# Altium schematic sheet DRV8300_VOLTAGE_REG.SchDoc
size B
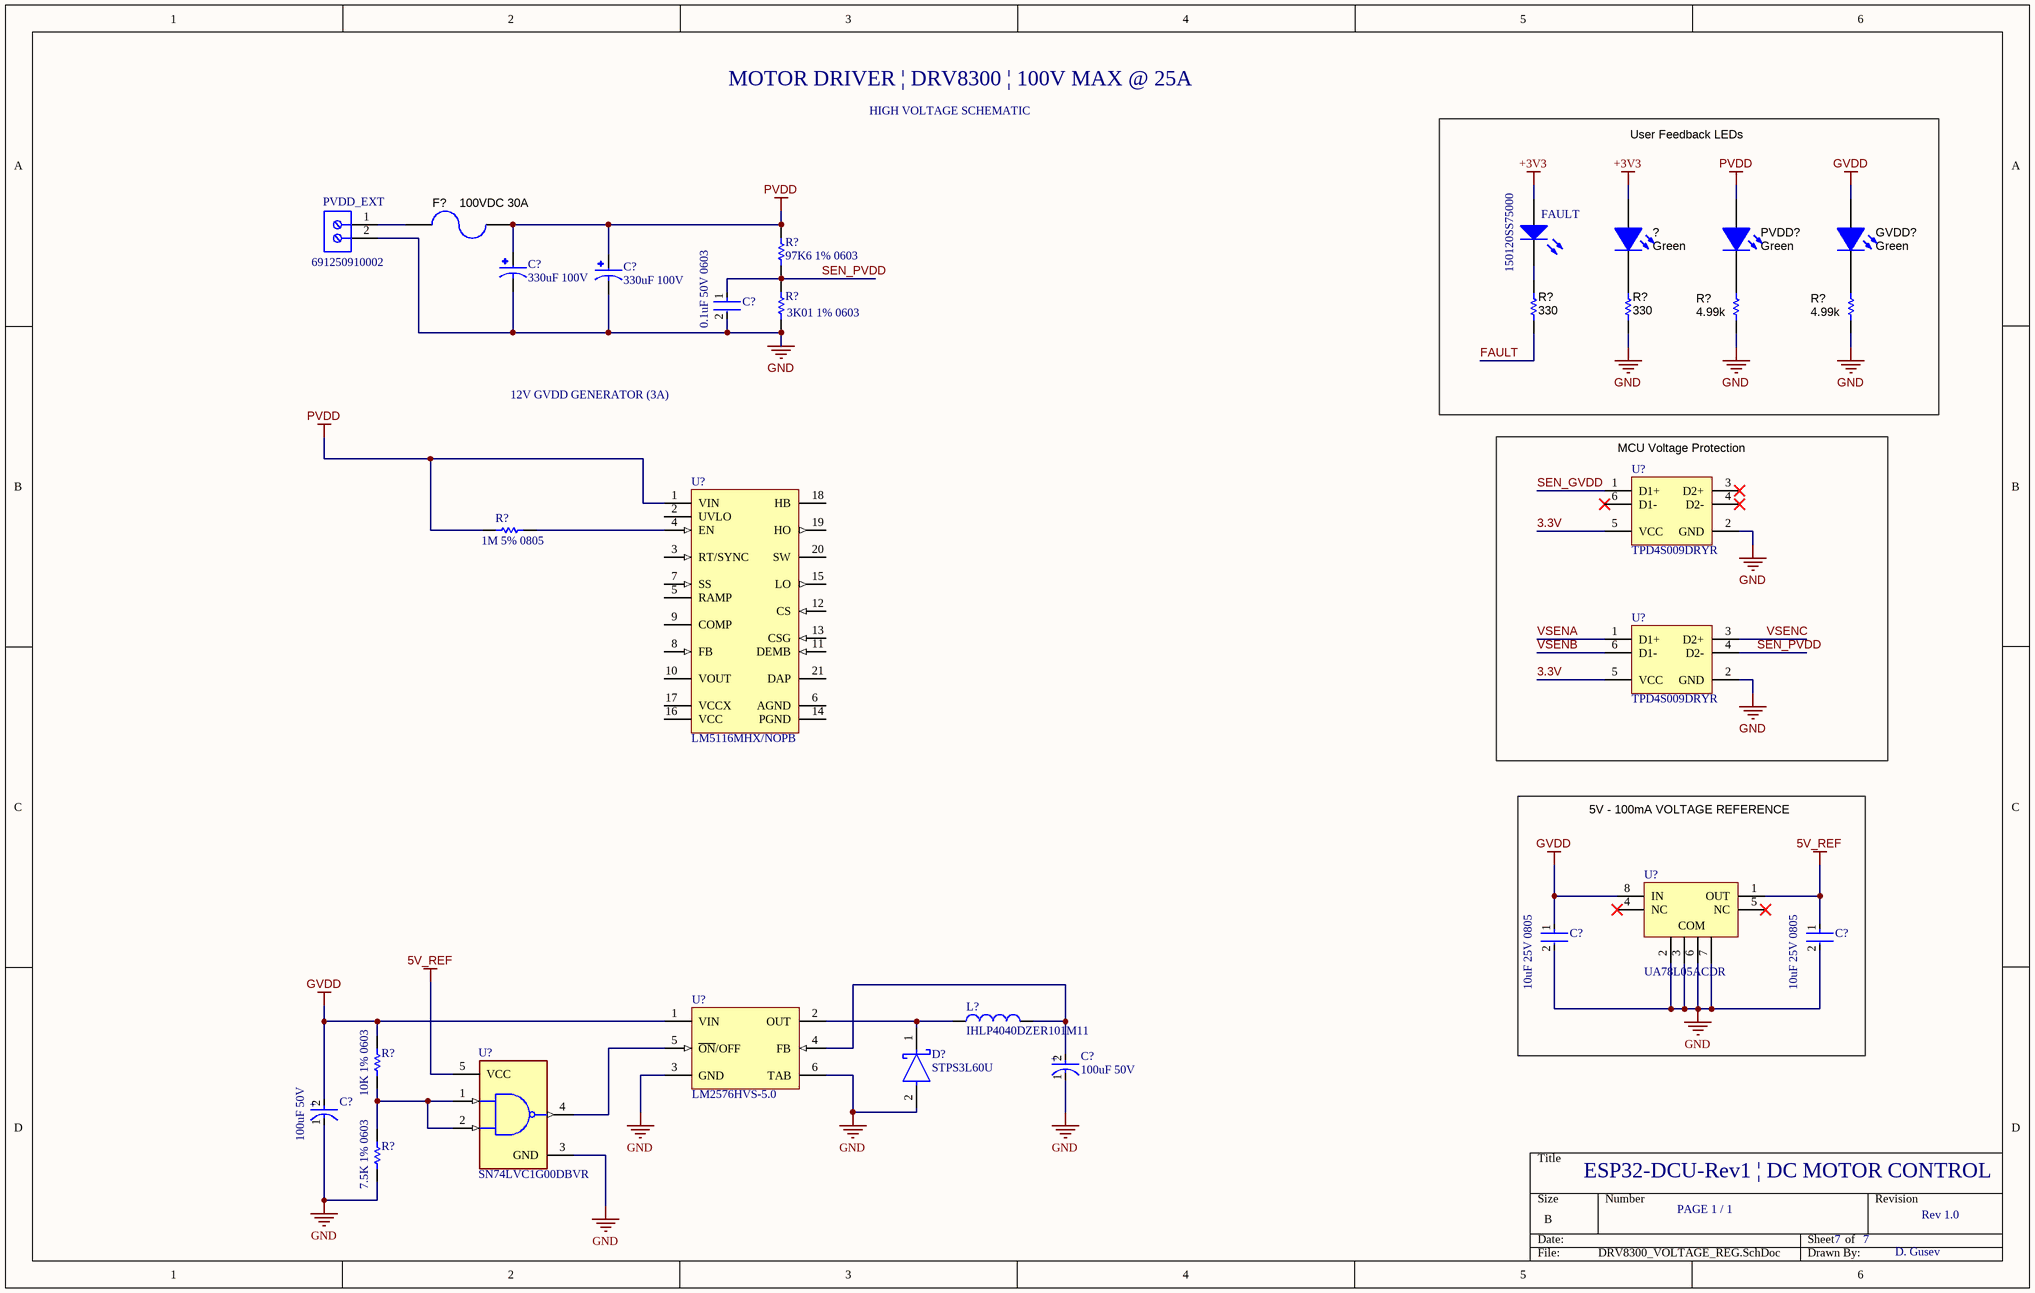
[diagram p0: DRV8300_VOLTAGE_REG.SchDoc]

## Parts
(Parts that share a designator on the sheet are numbered #1, #2 ... from top to bottom, then left to right.)
?  value Green  [LED_LTST-C171]
C?#1  330uF 100V  [CAP_330UF_100V_EEVFK2A331M]
C?#2  330uF 100V  [CAP_330UF_100V_EEVFK2A331M]
C?#3  0.1uF 50V 0603  [FP-C0603C-CF-MFG]
C?#4  10uF 25V 0805  [FP-GRM21B-0_15-IPC_C]
C?#5  10uF 25V 0805  [FP-GRM21B-0_15-IPC_C]
C?#6  100uF 50V  [FP-EEE-FK1H101P-MFG]
C?#7  100uF 50V  [FP-EEE-FK1H101P-MFG]
D?  STPS3L60U  [FP-SMB-MFG]
F?  100VDC 30A  [Fuse_0463]
FAULT  150120SS75000  [1206_A]
GVDD?  value Green  [LED_LTST-C171]
L?  IHLP4040DZER101M11  [VISH-IHLP4040DZER101M11_V]
PVDD?  value Green  [LED_LTST-C171]
PVDD_EXT  691250910002  [691250910002]
R?#1  97K6 1% 0603  [RESC1608X55X30NL15T15]
R?#2  ValueDisplayed: 330  [0603L]  (hidden comment: CRCW0603330RJNEA)
R?#3  ValueDisplayed: 330  [0603L]  (hidden comment: CRCW0603330RJNEA)
R?#4  value 4.99k  [0603L]  (hidden comment: CRCW06034K99FKEA)
R?#5  value 4.99k  [0603L]  (hidden comment: CRCW06034K99FKEA)
R?#6  3K01 1% 0603  [RESC1608X55X30LL15T15]
R?#7  1M 5% 0805  [RESC0805(2012)_L]
R?#8  10K 1% 0603  [RESC1608X55X25ML10T15]
R?#9  7.5K 1% 0603  [RESC1608X55X25ML10T15]
U?#1  TPD4S009DRYR  [DRY0006A]
U?#2  LM5116MHX/NOPB  [PWP0020A_M]
U?#3  TPD4S009DRYR  [DRY0006A]
U?#4  UA78L05ACDR  [D0008A_L]
U?#5  LM2576HVS-5.0  [KTT0005B_L]
U?#6  SN74LVC1G00DBVR  [FP-DBV0005A-MFG]

## Blocks framed on the sheet
User Feedback LEDs: ? FAULT GVDD? PVDD? R?#2-R?#5
MCU Voltage Protection: U?#1 U?#3
5V - 100mA VOLTAGE REFERENCE: C?#4 C?#5 U?#4

## Nets
5V_REF: C?#5.1 U?#4.1(OUT) U?#6.5(VCC)
+3V3: ?.1(A) FAULT.2(A)
GND: C?#1.2 C?#2.2 C?#3.2 C?#4.2 C?#5.2 C?#6.1(C) C?#7.1(C) D?.2(A) PVDD_EXT.2 R?#3.1 R?#4.1 R?#5.1 R?#6.1 R?#9.1 U?#1.2(GND) U?#3.2(GND) U?#4.2(COM) U?#4.3(COM) U?#4.6(COM) U?#4.7(COM) U?#5.3(GND) U?#5.6(TAB) U?#6.3(GND)
GVDD: C?#4.1 C?#7.2(A) GVDD?.1(A) R?#8.2 U?#4.8(IN) U?#5.1(VIN)
PVDD: C?#1.1 C?#2.1 F?.1 PVDD?.1(A) R?#1.2 R?#7.1 U?#2.1(VIN)
3.3V: U?#1.5(VCC) U?#3.5(VCC)
FAULT: R?#2.1
SEN_GVDD: U?#1.1(D1+)
SEN_PVDD: C?#3.1 R?#1.1 R?#6.2 U?#3.4(D2-)
VSENA: U?#3.1(D1+)
VSENB: U?#3.6(D1-)
VSENC: U?#3.3(D2+)
Net?_2: ?.2(K) R?#3.2
NetC?#6_2: C?#6.2(A) L?.2 U?#5.4(FB)
NetD?_1: D?.1(K) L?.1 U?#5.2(OUT)
NetF?_2: F?.2 PVDD_EXT.1
NetFAULT_1: FAULT.1(K) R?#2.2
NetGVDD?_2: GVDD?.2(K) R?#5.2
NetPVDD?_2: PVDD?.2(K) R?#4.2
NetR?#7_2: R?#7.2 U?#2.4(EN)
NetR?#8_1: R?#8.1 R?#9.2 U?#6.1(A) U?#6.2(B)
NetU?#5_5: U?#5.5(~{ON}/OFF) U?#6.4(Y)

Not connected (* = marked no-connect by the designer): U?#1 3(D2+)* 4(D2-)* 6(D1-)*; U?#2 2(UVLO) 3(RT/SYNC) 5(RAMP) 6(AGND) 7(SS) 8(FB) 9(COMP) 10(VOUT) 11(DEMB) 12(CS) 13(CSG) 14(PGND) 15(LO) 16(VCC) 17(VCCX) 18(HB) 19(HO) 20(SW) 21(DAP); U?#4 4(NC)* 5(NC)*

## Notes on the sheet
- MOTOR DRIVER | DRV8300 | 100V MAX @ 25A
- HIGH VOLTAGE SCHEMATIC
- 12V GVDD GENERATOR (3A)
- ESP32-DCU-Rev1 | DC MOTOR CONTROL
- PAGE 1 / 1
- 7
- Rev 1.0
- D. Gusev
- (in symbol CMP-2000-06208-2) +

## Library data of the parts
? GVDD? PVDD? = CMP-0002830-3: LED, Green, SMD; Manufacturer: Lite-On; PartNumber: LTST-C171GKT; Vf_V: 2.1V; Io_A: 20A; Value1: W; SizeArea_mm2: 2.5; SizeAreaWB_mm2: 6.75; SizeX_mm: 2; SizeY_mm: 1.25; SizeZ_mm: 1.2; CompType: LED; MountType: SMT; RoHS: Y; PackageReference: 0805 LED; Type: AlInGaP; Value2: 2.1V; Color: green; ComponentLink1URL: https://sps06.itg.ti.com/sites/KMS/crossdivteams/altium/docs/ComponentDatasheets/LTST-C171GKT.pdf; ComponentLink1Description: Datasheet link
C?#1 C?#2 = EEVFK2A331M: Cap Aluminum Lytic 330uF 100V 20% (18 X 16.5mm) SMD 0.153 Ohm 917mA 2000h 105C T/R; MP: EEV-FK2A331M; MF: Panasonic; Value: *; Package: RADIAL-2 Panasonic; Check_prices: https://www.snapeda.com/parts/EEV-FK2A331M/Panasonic%20Electronic%20Components/view-part/40548/?ref=eda; Price: None; SnapEDA_Link: https://www.snapeda.com/parts/EEV-FK2A331M/Panasonic%20Electronic%20Components/view-part/40548/?ref=snap; Availability: In Stock
C?#3 = CMP-2006-03061-2: CAP CER 0.1UF 50V X7R 0603; Manufacturer: KEMET; Manufacturer Part Number: C0603C104K5RACTU; Tolerance: 0.1; Description: C0603 0.10 μF X7R 30ppm/°C 10.00% 50 V; Temperature Coefficient: 30ppm/°C; Material: Ceramic; Automotive Grade: Grade 1; Value: 0.10 μF; Temperature: -55°C to +125°C; RoHS: TRUE; Temperature Range High: +125°C; Lead Free: Yes; Octopart: https://octopart.com/c0603c104k5ractu-kemet-139244; Digikey Description: CAP CER 0.1UF 50V X7R 0603; Category: Cap; Package: C0603C-CF; ComponentLink2Description: Datasheet; Temperature Range Low: -55°C; Device Class L1: Passive Components; Voltage Rating: 50 V; Automotive: Yes; Device Class L3: Ceramic Capacitors; ComponentLink2URL: https://api.kemet.com/component-edge/download/datasheet/C0603C100J5GACAUTO.pdf; Capacitance: 0.10 μF; Device Class L2: Capacitors; Temperature Characteristic: X7R; Height: 0.87mm
C?#4 C?#5 = CMP-2007-03541-2: Chip Multilayer Ceramic Capacitors for General Purpose, 0805, 10uF, X5R, 15%, 10%, 25V; Length: 2mm; Depth: 1.25mm; Termination: SMD/SMT; Voltage: 25V; Height: 1.25mm; Material: Ceramic; Thickness: 0.053inch; Radiation Hardening: No; Min Operating Temperature: -55°C; Width: 0.049inch; Package Quantity: 1; Mount: Surface Mount; Dielectric: X5R; Packaging: Tape and Reel; Capacitance: 10uF; Voltage Rating (DC): 25V; Lead Free: Lead Free; Max Operating Temperature: 85°C; Case Code (Imperial): 0805; Case/Package: 0805; Tolerance: 10%; Voltage Rating: 25V; Case Code (Metric): 2012
C?#6 C?#7 = CMP-2000-06208-2: CAP ALUM 100UF 20% 50V SMD; Manufacturer Part Number: EEE-FK1H101P; Manufacturer: Panasonic Electronic Components; Automotive Grade: Grade 2; Dissipation Factor: 10%; Life: 2000Hours; Ripple Current: 350mA; Material: Aluminum; Esr: 0.34Ω; Leakage Current: 50uA; Tolerance: 20%; Package: 0; ComponentLink2URL: https://industrial.panasonic.com/cdbs/www-data/pdf/RDE0000/ABA0000C1181.pdf; Temperature Range Low: -55°C; Voltage Rating: 50V; ComponentLink2Description: Datasheet; Category: Cap; Digikey Description: CAP ALUM 100UF 20% 50V SMD; Octopart: https://octopart.com/eeefk1h101p-panasonic-4642841; Automotive: Yes; Temperature: -55°C to +105°C; Capacitance: 100uF; Lead Free: Yes; Mouser Description: Cap Aluminum Lytic 100uF 50V 20% (8 X 10.2mm) SMD 350mA 2000h 105C Automotive T/R; Height: 10.5mm; Device Class L3: Aluminum Electrolytic Capacitors; Value: 100uF; Device Class L1: Passive Components; RoHS: TRUE; Device Class L2: Capacitors; Temperature Range High: +105°C
D? = CMP-12187-000023-1: DIODE SCHOTTKY 60V 3A SMB; Manufacturer: STMicroelectronics; Standoff Height: 0.05mm; Peak Reverse Current: 150uA; Max Junction Temp: +150°C; Max Surge Forward Current: 100A; Octopart: https://octopart.com/stps3l60u-stmicroelectronics-334329; Category: Diode; Height: 2.65mm; RoHS: TRUE; Mouser Description: Schottky diode Configuration: Single Housing type: DO-214AA=SMB Peak conducting-state current: 100 A; Forward Current: 3A; Manufacturer Part Number: STPS3L60U; Temperature: to +150°C; ComponentLink2URL: https://www.st.com/resource/en/datasheet/stps3l60.pdf; Max Repetitive Reverse Voltage: 60V; Device Class L1: Discrete Semiconductors; Automotive: No; Device Class L3: Schottky Diodes; Digikey Description: DIODE SCHOTTKY 60V 3A SMB; Lead Free: Yes; Temperature Range High: +150°C; Package: SMB; ComponentLink2Description: Datasheet; Device Class L2: Diodes
F? = CMP-0077200-3: Fuse, 30 A, 250 VAC, 100 VDC, SMD; PartNumber: 0463030.ER; Manufacturer: Littelfuse; VAC_V: 250V; SizeAreaWB_mm2: 61.952; Rtyp_Ohm: 1.93m; SizeArea_mm2: 31.512; MeltingTyp: 916; SizeZ_mm: 3.12; VDC_V: 100V; SizeX_mm: 10.1; Interrupt_AC: 100A; Interrupt_DC: 50A; Fuse Speed: Fast; Fuse Technology: Board Mount; TaMax_C: 125°C; TaMin_C: -55°C; ComponentLink1Description: Datasheet URL; RoHS: Y; Supplier Part Number 3: 576-0463030.ER; Supplier 1: Digi-Key; Irating_A: 30A; PackageReference: 10.1x3.12mm; Supplier Part Number 2: 64W8551; Supplier 2: Newark; SizeY_mm: 3.12; ComponentLink1URL: http://www.littelfuse.com/~/media/electronics/datasheets/fuses/littelfuse_fuse_463_datasheet.pdf.pdf; CompType: Fuse; MountType: SMT; Supplier Part Number 1: F6439CT-ND; Supplier 3: Mouser
FAULT = CMP-1426-00017-1: SMD mono-color Chip LED, WL-SMCW, Super Red; Manufacturer: Wuerth Elektronik; ComponentLink1URL: http://www.we-online.com; PackageReference: 1206_A; ComponentLink2Description: Datasheet; ComponentLink1Description: Manufacturer URL; ComponentLink2URL: http://katalog.we-online.com/led/datasheet/150120SS75000.pdf; Color: Super Red; PartNumber: 150120SS75000
L? = CMP-2000-06447-1: Low Profile, High Current IHLP(R) Inductor, 100 uH, +/- 20%, 2.5 A, -55 to 125 degC, 2-Pin SMD, RoHS, Tape and Reel; Manufacturer: Vishay; Qualification: AEC-Q200; Test Frequency: 100kHz; Maximum DC Resistance: 270mOhms; Type: LowProfileHighCurrentIHLPInductor; Inductance: 100uH; Unit Weight: 0.070548oz; Shielding: Shielded; Brand: Vishay/Dale; Maximum DC Current: 2.25A; Termination Style: SMD/SMT; Mounting Style: SMD/SMT; Tolerance: 20%; Factory Pack Quantity: 500; Product Category: FixedInductors; Mounting Technology: SurfaceMount; Manufacturer URL: http://www.vishay.com/; Operating Temperature Range: -55Cto+125C; Datasheet Version: 08/2015; Product: PowerInductors; Packaging: Reel; Length: 10.3mm; Package Description: 2-Pin Surface Mount Device, Body 10.3 x 10.3 mm; Height: 4mm; Width: 10.3mm; Series: IHLP-4040DZ-11; RoHS: True; Package Reference: IHLP4040DZER101M11; Tradename: IHLP; Datasheet URL: http://www.vishay.com/docs/34192/lp40dz11.pdf; Package / Case: 4040
PVDD_EXT = CMP-1502-02750-1: Serie 2509 - 9.52 mm Horizontal Entry Modular with Rising Cage Clamp WR-TBL, 2 pin; Manufacturer: Wurth Elektronik; Pin Number: 2; Pitch: 9.52mm; Datasheet URL: http://katalog.we-online.de/em/datasheet/6912509100XX.pdf; Mounting Technology: THT; Package Reference: 691250910002; Publisher: WurthElektronik; Packaging: Box; Manufacturer URL: http://www.we-online.de; Operating Temperature: -30to120degC; Part Number: 691250910002
R?#1 = CMP-2000-00697-1: Manufacturer: Panasonic; Part Number: ERJ-3EKF9762V
R?#2 R?#3 = CMP-0025785-4: RES, 330, 5%, 0.1 W, AEC-Q200 Grade 0, 0603; Manufacturer: Vishay-Dale; Power_W: 100mW; TempCo: 200 ppm/C; Value_Code: 330R; Value: 330; EIA_Code: E24; SizeX_mm: 1.6; SizeY_mm: 0.8; SizeZ_mm: 1; Value2: 0.1W; SizeArea_mm2: 1.28; CompType: Resistor; AEC Qualified: Y; VDC_V: 75V; AEC Category: Q200; AEC Grade: 0; Supplier Part Number 2: 59M6805; Supplier 2: Newark; Supplier Part Number 3: 71-CRCW0603J-330-E3; Supplier 3: Mouser; RoHS: E; Value1: 5%; MountType: SMT; Supplier 1: Digi-Key; PackageReference: 0603; Tolerance_%: 5%; Res_ohm: 330; PartNumber: CRCW0603330RJNEA; ComponentLink1Description: Datasheet link; Supplier Part Number 1: 541-330GCT-ND; Technology: Thick Film; ComponentLink1URL: http://www.vishay.com/docs/20035/dcrcwe3.pdf
R?#4 R?#5 = CMP-0022458-4: RES, 4.99 k, 1%, 0.1 W, AEC-Q200 Grade 0, 0603; Manufacturer: Vishay-Dale; Value_Code: 4k99; Power_W: 100mW; Value2: 0.1W; VDC_V: 75V; TempCo: 100 ppm/C; EIA_Code: E96; AEC Category: Q200; AEC Qualified: Y; AEC Grade: 0; SizeArea_mm2: 1.28; SizeX_mm: 1.6; SizeY_mm: 0.8; SizeZ_mm: 1; CompType: Resistor; PartNumber: CRCW06034K99FKEA; PackageReference: 0603; RoHS: E; Res_ohm: 4.99k; Tolerance_%: 1%; Value1: 1%; MountType: SMT; Technology: Thick Film; ComponentLink1Description: Datasheet link; ComponentLink1URL: http://www.vishay.com/docs/20035/dcrcwe3.pdf; Supplier 1: Digi-Key; Supplier Part Number 1: 541-4.99KHCT-ND; Supplier 2: Newark; Supplier Part Number 2: 52K8500; Supplier 3: Mouser; Supplier Part Number 3: 71-CRCW0603-4.99K-E3; ValueDisplayed: 4.99k
R?#6 = CMP-2000-00416-1: Part Number: ERJ-3EKF3011V; Manufacturer: Panasonic
R?#7 = CMP-1013-00146-1: 1M 0.125W 5% 0805 (2012 Metric)  SMD; Case-Metric: 2012; Value: 1000000.00 Ohm; Case-EIA: 0805; Technology: SMT; Tolerance: 5 %; Power: 0.125 W
R?#8 = CMP-2000-05022-1: Resistor, 10 KOhm, +/- 5%, 100 mW, -55 to 155 degC, 0603 (1608 Metric), RoHS, Tape and Reel; Manufacturer: Yageo; Resistance: 10kOhms; Voltage Rating: 50V; Temperature Coefficient: 100PPM/C; Power Rating: 100mW; Package Reference: 603; Series: RC; Case Code - mm: 1608; Packaging: Reel; Datasheet URL: http://www.farnell.com/datasheets/443971.pdf; Datasheet Version: Rev. 4, 04/2009; Operating Temperature Range: -55Cto+155C; Product: ThickFilmResistorsGeneralPurpose; Package Description: 2-Pin Surface Mount Device, Body 1.6 x 0.8 mm; Manufacturer URL: http://www.yageo.com/; Case Code - in: 0603; Tolerance: 5%; Termination Style: SMD/SMT
R?#9 = CMP-2000-04293-1: Manufacturer: Yageo; Part Number: RC0603JR-077K5L
U?#1 U?#3 = CMP-0326-00033-3: ESD Solution for High-Speed Differential Interface, 4 Channels, -40 to +85 degC, 6-pin SON (DRY), Green (RoHS & no Sb/Br); Manufacturer: Texas Instruments; Breakdown Voltage(Min)(V): 9; Differential Capacitance(pF): 0.05; IO Leakage Current(nA): Jan-00; IEC 61000-4-2 Contact(+/- kV): 8; IO Capacitance(Typ)(pF): 0.8; Mounting Technology: Surface Mount; ComponentLink3URL: SamplesURL:http://www.ti.com/product/tpd4s009#samples; ComponentLink2URL: http://www.ti.com/general/docs/lit/getliterature.tsp?genericPartNumber=TPD4S009&fileType=pdf; ComponentLink1Description: Manufacturer URL; PackageDescription: 6-Pin Plastic Small Outline No-Lead, 1 x 1.45 x 0.6 mm Body, 0.5 mm Pitch; IEC 61000-4-2 Air-Gap(+/- kV): 9; Eco-Plan: Green (RoHS & no Sb/Br); PartNumber: TPD4S009DRYR; PackageReference: DRY0006A; DatasheetVersion: SLVS817E; ComponentLink3Description: URL Link1; SubFamily: ESD Solution; ComponentLink1URL: http://www.ti.com/; PackageVersion: revF, Dec-2011; ComponentLink2Description: Datasheet
U?#2 = CMP-0069-01482-3: Wide Range Synchronous Buck Controller, 20-pin TSSOP-EP, Pb-Free; Manufacturer: Texas Instruments; PackageTopMarking: NSUZXYTT*LM5116*MH; PowerWise: Y; CompType: Switcher; ComponentLink1URL: http://www.ti.com/general/docs/lit/getliterature.tsp?genericPartNumber=LM5116&fileType=pdf; PackageReference: PWP0020A; RoHS: Y; PinCount: 20; Code_JEDEC: MO-153-ACT; PackageDescription: Molded TSSOP, Jedec, 6.5 x 4.4 x 0.9mm Body, 20 Lead, 0.65mm Pitch, Exposed Pad; ComponentLink1Description: Datasheet URL
U?#4 = CMP-0324-00139-3: Fixed Regulator with 7 to 20 V Input and 5 V Output, 0 to 125 degC, 8-Pin SOIC (D), Green (RoHS & no Sb/Br); Manufacturer: Texas Instruments; Iout(Max)(A): 0.1; Vout(Min)(V): 5; Iq(Typ)(mA): 6; Vin(Max)(V): 20; Vin(Min)(V): 7; ComponentLink2Description: Package Specification; PackageVersion: revM, Jun-2011; PartNumber: UA78L05ACDR; DatasheetVersion: SLVS010S; Eco-Plan: Green (RoHS & no Sb/Br); PackageDescription: 8-Pin Plastic Small Outline Integrated Circuit, 4.9 x 3.9 mm, Pitch 1.27 mm Pitch; ComponentLink1URL: http://www.ti.com/general/docs/lit/getliterature.tsp?genericPartNumber=UA78L05A&fileType=pdf; PackageReference: D0008A; ComponentLink1Description: Datasheet; ComponentLink3URL: Samples URL:http://www.ti.com/product/ua79m05#samples; Code_JEDEC: MS-012AA; ComponentLink2URL: http://www.ti.com/litv/pdf/msoi002j; Vout(Max)(V): 5; Mounting Technology: Surface Mount; ComponentLink3Description: URL Link1
U?#5 = CMP-0069-00141-3: SIMPLE SWITCHER® 3A Step-Down Voltage Regulator, 5-pin TO-263; Manufacturer: Texas Instruments; PackageTopMarking: NSUZXYTTE#*LM2576*HVS-5.0 P+; PowerWise: N; RoHS: N; PackageDescription: TO-263, Molded, .400 x .390 x .180in, 5 Lead, .067in Pitch, Surface Mount; Code_JEDEC: MO-169-AB; CompType: Switcher; ComponentLink1URL: http://www.ti.com/general/docs/lit/getliterature.tsp?genericPartNumber=LM2576HV&fileType=pdf; ComponentLink1Description: Datasheet URL; PinCount: 5; PackageReference: KTT0005B
U?#6 = CMP-0859-00113-4: IC GATE NAND 1CH 2-INP SOT23-5; Manufacturer: Texas Instruments; Logic Function Desc: Inverting; Number Of Circuits: 1; Nominal Supply Current: 10uA; Max Supply Voltage: 5.5V; Standoff Height: 0mm; Frequency: 100MHz; Propagation Delay: 4.3ns; Min Supply Voltage: 1.65V; Description: NAND Gate IC 1 Channel SOT-23-5; Number Of Inputs: 2; Digikey Description: IC GATE NAND 1CH 2-INP SOT23-5; Ipc Land Pattern Name: SOT95P280X145-5; Automotive: No; RoHS: TRUE; Mouser Description: IC Mos 74LVC1G00/SO/SN74LVC1G00DBVR TEXAS INSTRUMENT RoHS LVC SOt23; Package: DBV0005A; ComponentLink2URL: http://www.ti.com/lit/ds/symlink/sn74lvc1g00.pdf; Device Class L2: Logic ICs; Ambient Temperature Range Low: -40°C; Temperature Range Low: -40°C; Ambient Temperature Range High: +125°C; Device Class L1: Integrated Circuits (ICs); Height: 1.45mm; Octopart: https://octopart.com/sn74lvc1g00dbvr-texas+instruments-465560; Temperature: -40°C to +125°C; Temperature Range High: +125°C; Category: IC; ComponentLink2Description: Datasheet; Number Of Outputs: 1; Device Class L3: Logic Gates; Manufacturer Part Number: SN74LVC1G00DBVR; Lead Free: Yes